# Altium schematic sheet Lights.SchDoc: Bottom Light Array
size A4; DrawnBy: Mark Harris; Engineer: Mark Harris; Organization: Celestial Reach; Address1: Mark Harris; DocumentNumber: 1; Revision: 0; SheetNumber: 1; SheetTotal: 1
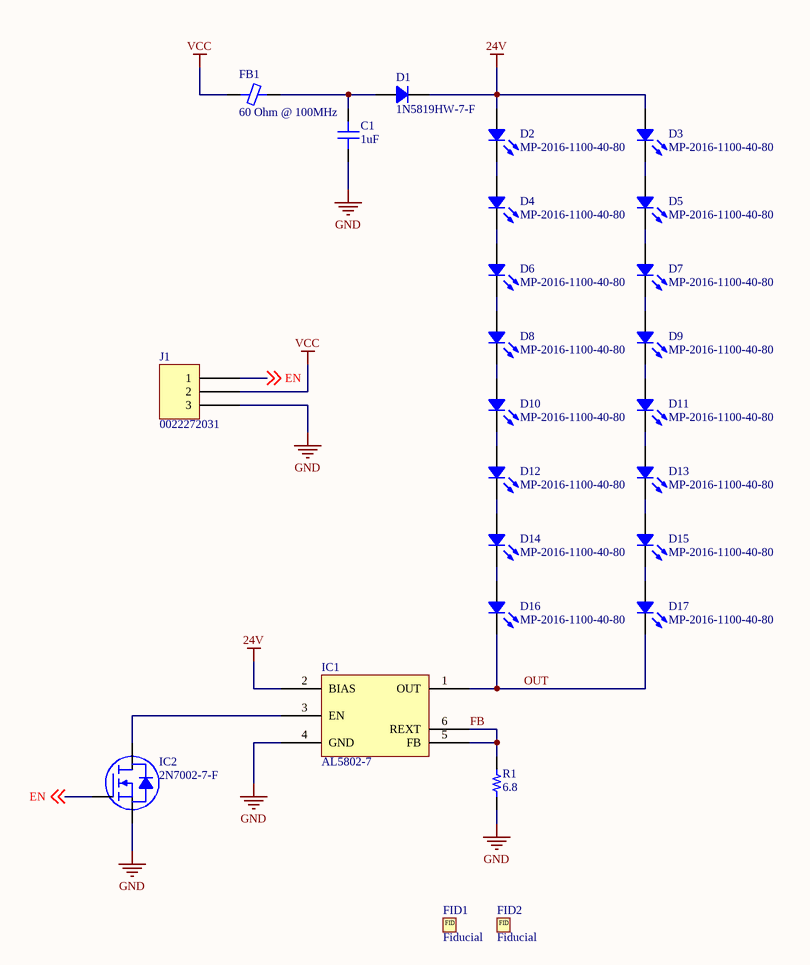
[diagram p0: Lights.SchDoc]

## Parts
C1  1uF  [CAP 0603/1608]
D1  1N5819HW-7-F  [SOD-123]
D2  MP-2016-1100-40-80  [LUMINUS MP-2016]
D3  MP-2016-1100-40-80  [LUMINUS MP-2016]
D4  MP-2016-1100-40-80  [LUMINUS MP-2016]
D5  MP-2016-1100-40-80  [LUMINUS MP-2016]
D6  MP-2016-1100-40-80  [LUMINUS MP-2016]
D7  MP-2016-1100-40-80  [LUMINUS MP-2016]
D8  MP-2016-1100-40-80  [LUMINUS MP-2016]
D9  MP-2016-1100-40-80  [LUMINUS MP-2016]
D10  MP-2016-1100-40-80  [LUMINUS MP-2016]
D11  MP-2016-1100-40-80  [LUMINUS MP-2016]
D12  MP-2016-1100-40-80  [LUMINUS MP-2016]
D13  MP-2016-1100-40-80  [LUMINUS MP-2016]
D14  MP-2016-1100-40-80  [LUMINUS MP-2016]
D15  MP-2016-1100-40-80  [LUMINUS MP-2016]
D16  MP-2016-1100-40-80  [LUMINUS MP-2016]
D17  MP-2016-1100-40-80  [LUMINUS MP-2016]
FB1  60 Ohm @ 100MHz  [FER 0603/1608]
FID1  Fiducial  [1MM FID]  (no BOM)
FID2  Fiducial  [1MM FID]  (no BOM)
IC1  AL5802-7  [DIODES SOT-23-6 W6]
IC2  2N7002-7-F  [DIODES SOT-23-3]
J1  0022272031  [MOLEX KK 0022272031]
R1  6.8  [RES 0805/2012]

## Nets
24V: D1.2 D2.1 D3.1 IC1.2(BIAS)
GND: C1.1 IC1.4(GND) IC2.3(S) J1.3 R1.1
VCC: FB1.1 J1.2
EN: IC2.1(G) J1.1 ; off-sheet EN
FB: IC1.5(FB) IC1.6(REXT) R1.2
OUT: D16.2 D17.2 IC1.1(OUT)
NetC1_2: C1.2 D1.1 FB1.2
NetD2_2: D2.2 D4.1
NetD3_2: D3.2 D5.1
NetD4_2: D4.2 D6.1
NetD5_2: D5.2 D7.1
NetD6_2: D6.2 D8.1
NetD7_2: D7.2 D9.1
NetD8_2: D8.2 D10.1
NetD9_2: D9.2 D11.1
NetD10_2: D10.2 D12.1
NetD11_2: D11.2 D13.1
NetD12_2: D12.2 D14.1
NetD13_2: D13.2 D15.1
NetD14_2: D14.2 D16.1
NetD15_2: D15.2 D17.1
NetIC1_3: IC1.3(EN) IC2.2(D)

## Notes on the sheet
- Title
- Size:
- Date:
- A4
- Number:
- Time:
- Revision:
- Sheet
- of
- File:
- (in symbol Fiducial) FID

## Library data of the parts
C1 = UMK107AB7105KA-T: CAP CER 1UF 50V X7R 0603; Manufacturer: Taiyo Yuden; TemperatureRange: -55C ~ 125C; Tolerance: 10%; Value: 1uF; Part Number: UMK107AB7105KA-T; PartId: 5655; Supplier 1: Digi-Key; Supplier Part Number 1: 587-3247-2-ND; ComponentLink1Description: Datasheet; ComponentLink1URL: http://ds.yuden.co.jp/TYCOMPAS/ut/detail.do?productNo=UMK107AB7105KA-T&fileName=UMK107AB7105KA-T_SS&mode=specSheetDownload; ComponentLink2Description: Digi-Key listing; ComponentLink2URL: http://digikey.com/product-detail/en/UMK107AB7105KA-T/587-3247-2-ND/3660085; TemperatureCoefficient: X7R; Voltage: 50V; Price: 0.066; Type: -; Device Package: 0603 (1608 Metric)
D1 = 1N5819HW-7-F: DIODE SCHOTTKY 40V 1A SOD123; Manufacturer: Diodes Incorporated; Current Reverse Leakage @ Vr: 1mA @ 40V; Voltage Forward (Vf): 450mV @ 1A; Part Number: 1N5819HW-7-F; PartId: 14604; Supplier 1: Digi-Key; Supplier Part Number 1: 1N5819HW-FDITR-ND; ComponentLink1Description: Datasheet; ComponentLink1URL: http://www.diodes.com/_files/datasheets/ds30217.pdf; ComponentLink2Description: Digi-Key Listing; ComponentLink2URL: https://www.digikey.com/product-detail/en/diodes-incorporated/1N5819HW-7-F/1N5819HW-FDITR-ND/814970; Junction Operating Temperature: -65C ~ 125C; Price: 0.08; Type: Schottky; Device Package: SOD-123; Voltage DC Reverse (Vr): 40V; Current Rectified: 1A
D2-D17 = MP-2016-1100-40-80: LED XNOVA NEUTRAL WHT 4000K 0806; Manufacturer: Luminus Devices Inc.; Value: Green; Colour: White, Neutral; Voltage Forward: 3V; Current (Test): 60mA; Viewing Angle: 110; Part Number: MP-2016-1100-40-80; PartId: 10866; Supplier 1: Digi-Key; Supplier Part Number 1: 1214-1212-2-ND; ComponentLink1Description: Datasheet; ComponentLink1URL: http://www.luminus.com/products/PDS-002326%20Mid%20Power%202016%20Rev6.pdf; ComponentLink2Description: Digi-Key Listing; ComponentLink2URL: https://www.digikey.com/product-detail/en/luminus-devices-inc/MP-2016-1100-40-80/1214-1212-2-ND/4807631; Price: 0.042; Device Package: 0806 (2016 Metric)
FB1 = CIC10J600NC: FERRITE CHIP 60 OHM 2000MA 0603; Manufacturer: Samsung Electro-Mechanics America, Inc.; Type: Differential Mode - Single; DC Resistance: 50 mOhm Max; Current Rating: 2A; Part Number: CIC10J600NC; PartId: 6580; Value: 60 Ohm @ 100MHz; Supplier 1: Digi-Key; Supplier Part Number 1: 1276-6357-2-ND; ComponentLink1Description: Datasheet; ComponentLink1URL: http://www.samsungsem.com/kr/front/downloadcms.do?path=/kr/support/product-search/bead/__icsFiles/afieldfile/2014/11/13&fileName=S_CIC10J121NC.pdf; ComponentLink2Description: Digi-Key listing; ComponentLink2URL: http://digikey.com/product-detail/en/CIC10J600NC/1276-6357-2-ND/3973732; Price: 0.0142; Device Package: 0603 (1608 Metric)
IC1 = AL5802-7: IC LED DRVR LIN DIM 120MA SOT26; Manufacturer: Diodes Incorporated; Internal Switch(s): Yes; Number Of Outputs: 1; Voltage - Supply (Min): 4.5V; Voltage - Supply (Max): 30V; Voltage - Output: 0.8 V ~ 30 V; Part Number: AL5802-7; PartId: 10864; Supplier 1: Digi-Key; Supplier Part Number 1: AL5802-7DITR-ND; ComponentLink1Description: Datasheet; ComponentLink1URL: http://www.diodes.com/_files/datasheets/AL5802.pdf; ComponentLink2Description: Digi-Key Listing; ComponentLink2URL: http://www.digikey.com/product-detail/en/diodes-incorporated/AL5802-7/AL5802-7DITR-ND/2792417; Device Package: SOT-23-6; Price: 0.1105; Type: Linear; Series: -; Applications: Signage; Operating Temperature: -40C ~ 125C (TA); Topology: -; Current Output / Channel: 120mA; Frequency: -
IC2 = 2N7002-7-F: MOSFET N-CH 60V 115MA SOT23-3; Manufacturer: Diodes Incorporated; Rds On (Max) at Id, Vgs: 7.5 Ohm @ 50mA, 5V; Vgs(th) (Max) at Id: 2.5V @ 250uA; Input Capacitance (Ciss) at Vds: 50pF @ 25V; Power - Max: 370mW; Current Continuous Drain: 115mA (Ta); Part Number: 2N7002-7-F; PartId: 7967; Supplier 1: Digi-Key; Supplier Part Number 1: 2N7002-FDITR-ND; ComponentLink1Description: Datasheet; ComponentLink1URL: http://www.diodes.com/_files/datasheets/ds11303.pdf; ComponentLink2Description: Digi-Key Listing; ComponentLink2URL: http://www.digikey.com/product-detail/en/2N7002-7-F/2N7002-FDITR-ND/717681; Price: 0.0255; Type: MOSFET N-Channel, Metal Oxide; Device Package: TO-236-3, SC-59, SOT-23-3; Gate Charge (Qg): -; Drain to Source Voltage (Vdss): 60V; Features: Standard
J1 = 0022272031: CONN HEADER 3POS .100 VERT TIN; Manufacturer: Molex, LLC; Pitch: 0.100" (2.54mm); Number Of Positions: 3; Part Number: 0022272031; PartId: 9720; Supplier 1: Digi-Key; Supplier Part Number 1: WM4112-ND; ComponentLink1Description: Datasheet; ComponentLink1URL: http://www.molex.com/pdm_docs/sd/022272031_sd.pdf; ComponentLink2Description: Digi-Key Listing; ComponentLink2URL: http://www.digikey.com/product-search/en?keywords=22-27-2031; Price: 0.35; Type: Header, Unshrouded; Contact Finish: Tin; Fastening Type: Friction Lock; Number Of Rows: 1; Colour: Natural; Series: KK 6410
R1 = ERJ-6RQF6R8V: RES SMD 6.8 OHM 1% 1/8W 0805; Manufacturer: Panasonic Electronic Components; TemperatureRange: -55C ~ 125C; TemperatureCoefficient: 200ppm/C; PowerRating: 0.125W, 1/8W; Value: 6.8; Part Number: ERJ-6RQF6R8V; PartId: 2569; Supplier 1: Digi-Key; Supplier Part Number 1: P6.8DTR-ND; ComponentLink1Description: Datasheet; ComponentLink1URL: http://industrial.panasonic.com/lecs/www-data/pdf/AOA0000/AOA0000CE3.pdf; ComponentLink2Description: Digi-Key listing; ComponentLink2URL: http://digikey.com/product-detail/en/ERJ-6RQF6R8V/P6.8DTR-ND/250182; Tolerance: 1%; Price: 0.0593; Type: Thick Film; Device Package: 0805 (2012 Metric)